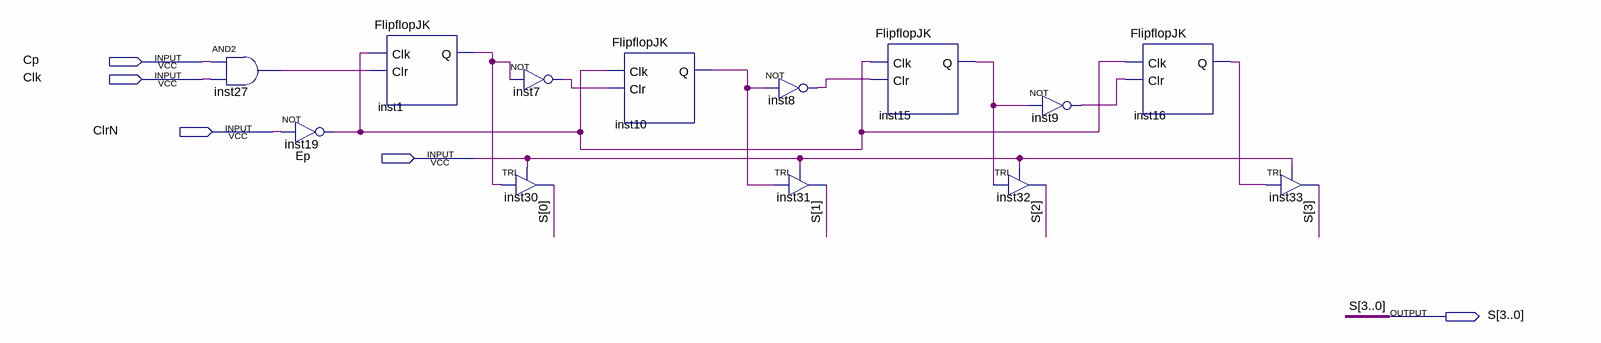
[diagram p0: schematic sheet]
// Quartus schematic Contador.bdf as structural Verilog: 13 symbols, 5 pins
module Contador (
  input  Cp,
  input  Clk,
  input  ClrN,
  input  Ep,
  output [3:0] S
);

  wire inst1_q, inst7_out, inst8_out, inst9_out, inst10_q, inst15_q, inst16_q, inst19_out, inst27_out;

  and inst27 (inst27_out, Cp, Clk);
  not inst19 (inst19_out, ClrN);
  FlipflopJK inst1 (.Clk(inst19_out), .Clr(inst27_out), .Q(inst1_q));
  not inst7 (inst7_out, inst1_q);
  TRI inst30 (.IN(inst1_q), .OE(Ep), .OUT(S[0]));
  FlipflopJK inst10 (.Clk(inst19_out), .Clr(inst7_out), .Q(inst10_q));
  not inst8 (inst8_out, inst10_q);
  TRI inst31 (.IN(inst10_q), .OE(Ep), .OUT(S[1]));
  FlipflopJK inst15 (.Clk(inst19_out), .Clr(inst8_out), .Q(inst15_q));
  not inst9 (inst9_out, inst15_q);
  TRI inst32 (.IN(inst15_q), .OE(Ep), .OUT(S[2]));
  FlipflopJK inst16 (.Clk(inst19_out), .Clr(inst9_out), .Q(inst16_q));
  TRI inst33 (.IN(inst16_q), .OE(Ep), .OUT(S[3]));
endmodule
